# Altium schematic sheet SCX10.SchDoc
size A4
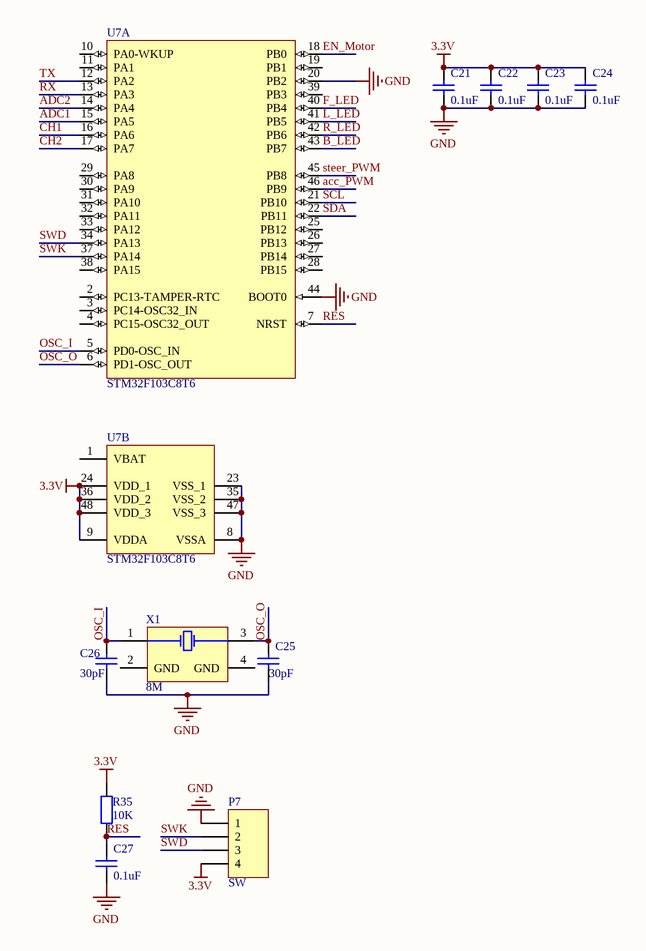
[diagram p0: SCX10.SchDoc]

## Parts
C21  0.1uF  [C0603]
C22  0.1uF  [C0603]
C23  0.1uF  [C0603]
C24  0.1uF  [C0603]
C25  30pF  [C0603]
C26  30pF  [C0603]
C27  0.1uF  [C0603]
P7  SW  [HDR1X4]
R35  10K  [R0603]
U7  STM32F103C8T6  [STM-LQFP48-L]  (parts A,B of 2)
X1  8M  [XTAL-8M]

## Nets
3.3V: C21.2 C22.2 C23.2 C24.2 P7.4 R35.2 U7.9(VDDA) U7.24(VDD_1) U7.36(VDD_2) U7.48(VDD_3)
GND: C21.1 C22.1 C23.1 C24.1 C25.1 C26.1 C27.1 P7.1 U7.8(VSSA) U7.20(PB2) U7.23(VSS_1) U7.35(VSS_2) U7.44(BOOT0) U7.47(VSS_3)
acc_PWM: U7.46(PB9)
ADC1: U7.15(PA5)
ADC2: U7.14(PA4)
B_LED: U7.43(PB7)
CH1: U7.16(PA6)
CH2: U7.17(PA7)
EN_Motor: U7.18(PB0)
F_LED: U7.40(PB4)
L_LED: U7.41(PB5)
OSC_I: C26.2 U7.5(PD0-OSC_IN) X1.1(X1)
OSC_O: C25.2 U7.6(PD1-OSC_OUT) X1.3(X2)
R_LED: U7.42(PB6)
RES: C27.2 R35.1 U7.7(NRST)
RX: U7.13(PA3)
SCL: U7.21(PB10)
SDA: U7.22(PB11)
steer_PWM: U7.45(PB8)
SWD: P7.3 U7.34(PA13)
SWK: P7.2 U7.37(PA14)
TX: U7.12(PA2)

Not connected (* = marked no-connect by the designer): U7 1(VBAT) 2(PC13-TAMPER-RTC) 3(PC14-OSC32_IN) 4(PC15-OSC32_OUT) 10(PA0-WKUP) 11(PA1) 19(PB1) 25(PB12) 26(PB13) 27(PB14) 28(PB15) 29(PA8) 30(PA9) 31(PA10) 32(PA11) 33(PA12) 38(PA15) 39(PB3); X1 2(GND) 4(GND)

## Library data of the parts
C21-C27 = Cap: Capacitor; Value: 100pF; Published: 8-Jun-2000; LatestRevisionDate: 17-Jul-2002; LatestRevisionNote: Re-released for DXP Platform.; PackageReference: RAD-0.3; Publisher: Altium Limited; PackageDescription: Radial Cap, Thru-Hole; 2 Leads; 0.3 in Pin Spacing
P7 = Header 4: Header, 4-Pin; LatestRevisionDate: 17-Jul-2002; LatestRevisionNote: Re-released for DXP Platform.; Publisher: Altium Limited
R35 = Res2: Resistor; Value: 1K; Published: 8-Jun-2000; LatestRevisionDate: 17-Jul-2002; LatestRevisionNote: Re-released for DXP Platform.; PackageReference: AXIAL-0.4; Publisher: Altium Limited; PackageDescription: Axial Device, Thru-Hole; 2 Leads; 0.4 in Pin Spacing
X1 = XTAL-8M